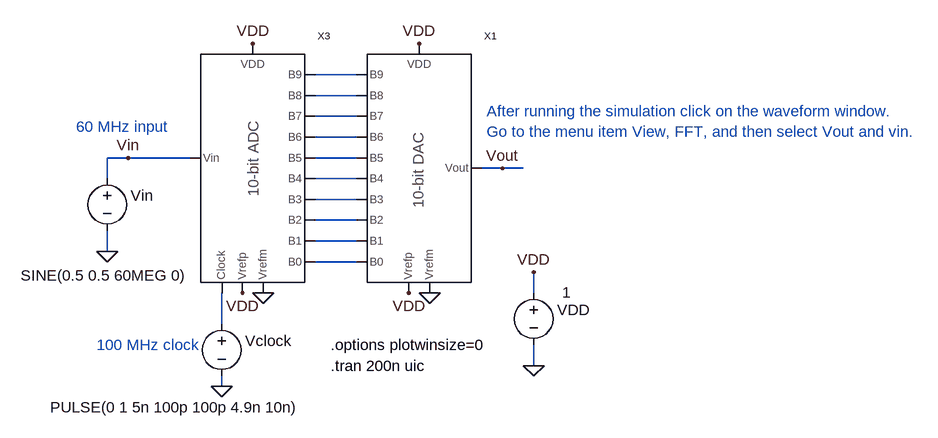
[diagram p0: schematic Fig28_25.asc]
Fig28_25.asc, the LTspice schematic file:
Version 4
SHEET 1 2516 1160
WIRE 1568 576 1504 576
WIRE 1568 608 1504 608
WIRE 1568 640 1504 640
WIRE 1568 672 1504 672
WIRE 1216 704 1184 704
WIRE 1312 704 1216 704
WIRE 1568 704 1504 704
WIRE 1792 720 1760 720
WIRE 1824 720 1792 720
WIRE 1184 736 1184 704
WIRE 1568 736 1504 736
WIRE 1568 768 1504 768
WIRE 1568 800 1504 800
WIRE 1568 832 1504 832
WIRE 1184 848 1184 816
WIRE 1568 864 1504 864
WIRE 1840 912 1840 880
WIRE 1360 960 1360 912
WIRE 1840 1024 1840 992
WIRE 1360 1056 1360 1040
FLAG 1360 1056 0
FLAG 1792 720 Vout
FLAG 1680 912 0
FLAG 1648 912 VDD
FLAG 1664 528 VDD
FLAG 1840 1024 0
FLAG 1840 880 VDD
FLAG 1408 528 VDD
FLAG 1424 912 0
FLAG 1392 912 VDD
FLAG 1184 848 0
FLAG 1216 704 Vin
SYMBOL voltage 1360 944 R0
WINDOW 0 36 42 Left 0
WINDOW 3 -264 144 Left 0
WINDOW 123 0 0 Left 0
WINDOW 39 0 0 Left 0
SYMATTR InstName Vclock
SYMATTR Value PULSE(0 1 5n 100p 100p 4.9n 10n)
SYMBOL voltage 1840 896 R0
WINDOW 0 36 42 Left 0
WINDOW 3 44 15 Left 0
WINDOW 123 0 0 Left 0
WINDOW 39 0 0 Left 0
SYMATTR InstName VDD
SYMATTR Value 1
SYMBOL voltage 1184 720 R0
WINDOW 0 36 42 Left 0
WINDOW 3 -133 165 Left 0
WINDOW 123 0 0 Left 0
WINDOW 39 0 0 Left 0
SYMATTR InstName Vin
SYMATTR Value SINE(0.5 0.5 60MEG 0)
SYMBOL Ideal_10_bit_ADC 1328 896 R0
SYMATTR InstName X3
SYMBOL Ideal_10_bit_DAC 1584 896 R0
SYMATTR InstName X1
TEXT 1528 1024 Left 0 !.tran 200n uic
TEXT 1528 992 Left 0 !.options plotwinsize=0
TEXT 1136 656 Left 0 ;60 MHz input
TEXT 1168 992 Left 0 ;100 MHz clock
TEXT 1768 632 Left 0 ;After running the simulation click on the waveform window.\nGo to the menu item View, FFT, and then select Vout and vin.

The netlist it stands for:
* Fig28_25.asc
Vclock N011 0 PULSE(0 1 5n 100p 100p 4.9n 10n)
VDD VDD 0 1
Vin Vin 0 SINE(0.5 0.5 60MEG 0)
XX3 N010 N009 N008 N007 N006 N005 N004 N003 N002 N001 Vin VDD 0 N011 VDD Ideal_10_bit_ADC  ; pins B0 B1 B2 B3 B4 B5 B6 B7 B8 B9 Vin Vrefp Vrefm Clock VDD
XX1 N010 N009 N008 N007 N006 N005 N004 N003 N002 N001 Vout VDD 0 VDD Ideal_10_bit_DAC  ; pins B0 B1 B2 B3 B4 B5 B6 B7 B8 B9 Vout Vrefp Vrefm VDD
.tran 200n uic
.options plotwinsize=0
* 60 MHz input
* 100 MHz clock
* After running the simulation click on the waveform window.
* Go to the menu item View, FFT, and then select Vout and vin.
.backanno
.end